# EAGLE design espuno (EAGLE 7.4.0)
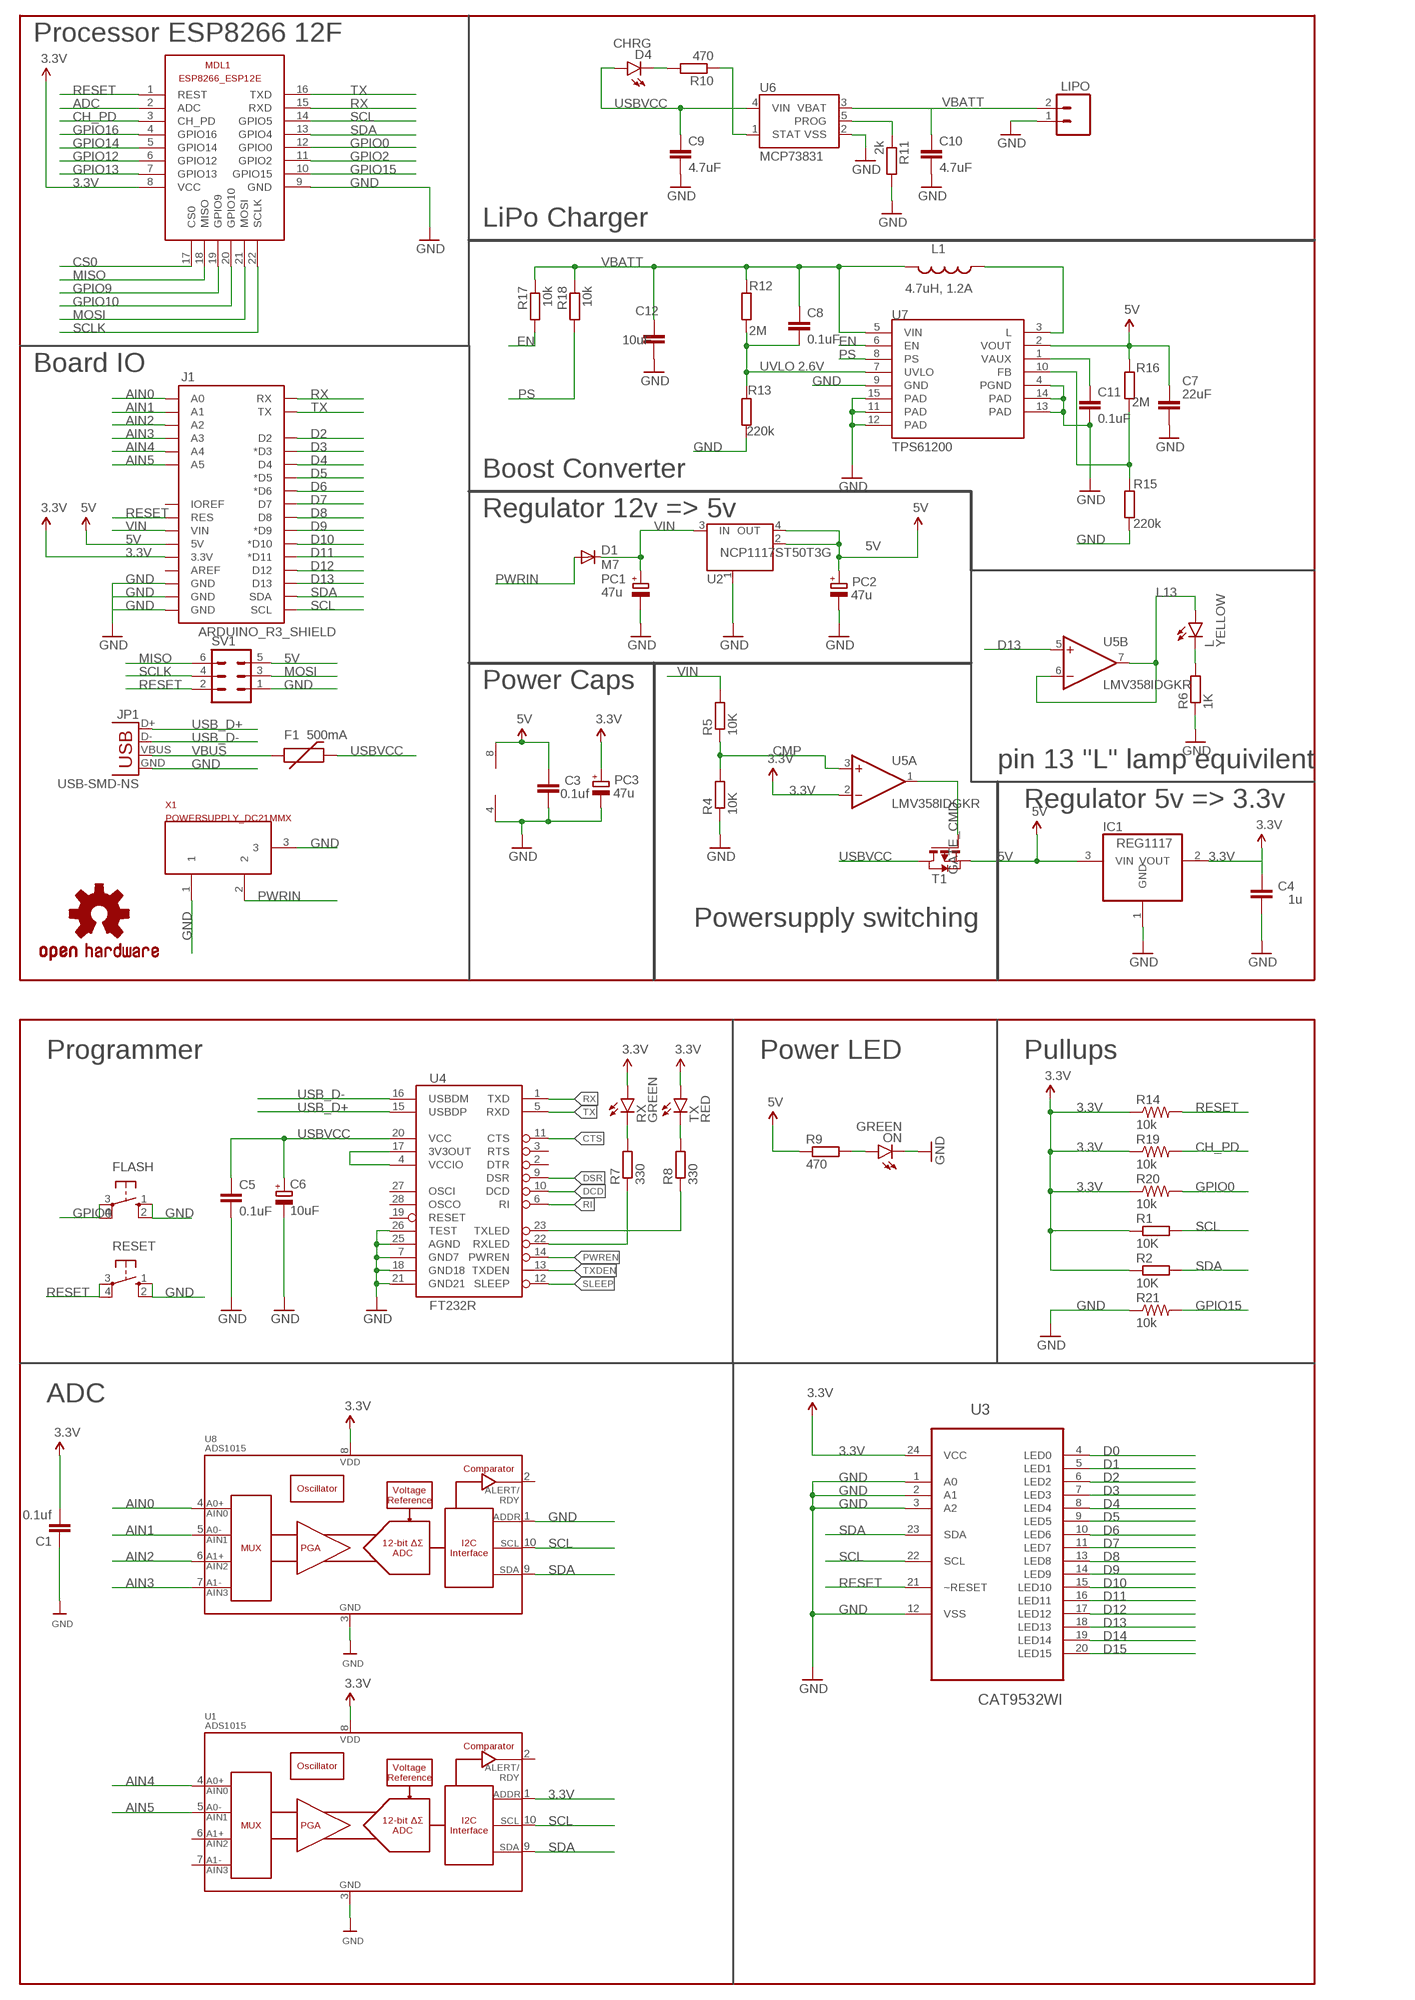
[diagram p0: schematic, sheet 1]

## Parts
C1  0.1uf  CAP1206  [1206]
C3  0.1uf  C-EUC1206K  [C1206K]
C4  1u  C-EUC1206K  [C1206K]
C5  0.1uF  C-EUC1206K  [C1206K]
C6  10uF  CPOL-EUSMCA  [SMC_A]
C7  22uF  C-EUC1206K  [C1206K]
C8  0.1uF  C-EUC1206K  [C1206K]
C9  4.7uF  C-EUC1206K  [C1206K]
C10  4.7uF  C-EUC1206K  [C1206K]
C11  0.1uF  C-EUC1206K  [C1206K]
C12  10uF  C-EUC1206K  [C1206K]
D1  M7  DIODE-SMB  [SMB]
D4  CHRG  LED1206  [LED-1206]
F1  500mA  PTCSMD  [PTC-1206]
FLASH  10-XX  [B3F-10XX]
FRAME1  FRAME-LETTERNO_PACKAGE  [DUMMY]
FRAME2  FRAME-LETTERNO_PACKAGE  [DUMMY]
IC1  REG1117  [SOT223]
J1  ARDUINO_R3_SHIELD  [UNO_R3_SHIELD]
JP1  USB-SMD-NS  [USB-MINIB-NOSTOP]
L  YELLOW  LED1206  [LED-1206]
L1  4.7uH, 1.2A  INDUCTOR.  [CDRH2D09]
LIPO  M02JST-PTH-2  [JST-2-PTH]
LOGO1  OSHW-LOGOS  [OSHW-LOGO-S]
MDL1  ESP8266-12EESP8266-ESP12E  [ESP8266-ESP12E]
ON  GREEN  LED1206  [LED-1206]
PC1  47u  CPOL-EUD  [PANASONIC_D]
PC2  47u  CPOL-EUD  [PANASONIC_D]
PC3  47u  CPOL-EUD  [PANASONIC_D]
R1  10K  R-EU_M1206  [M1206]
R2  10K  R-EU_M1206  [M1206]
R4  10K  R-EU_M1206  [M1206]
R5  10K  R-EU_M1206  [M1206]
R6  1K  R-EU_M1206  [M1206]
R7  330  R-EU_M1206  [M1206]
R8  330  R-EU_M1206  [M1206]
R9  470  R-EU_M1206  [M1206]
R10  470  R-EU_M1206  [M1206]
R11  2k  R-EU_M1206  [M1206]
R12  2M  R-EU_M1206  [M1206]
R13  220k  R-EU_M1206  [M1206]
R14  10k  RESISTOR1206  [1206]
R15  220k  R-EU_M1206  [M1206]
R16  2M  R-EU_M1206  [M1206]
R17  10k  R-EU_M1206  [M1206]
R18  10k  R-EU_M1206  [M1206]
R19  10k  RESISTOR1206  [1206]
R20  10k  RESISTOR1206  [1206]
R21  10k  RESISTOR1206  [1206]
RESET  10-XX  [B3F-10XX]
RX  GREEN  LED1206  [LED-1206]
SV1  MA03-2  [MA03-2]
T1  FDN340P  PMOSSOT23  [SOT-23]
TX  RED  LED1206  [LED-1206]
U1  ADS1015  [MSOP10]
U2  NCP1117ST50T3G  MC33269ST-3.3T3  [SOT223]
U3  CAT9532WI  [SOIC127P1031X265-24N]
U4  FT232R  FT232RLSSOP  [SSOP28DB]
U5  LMV358IDGKR  LMV358MMX  [MSOP08]
U6  MCP73831  [SOT23-5]
U7  TPS61200  [QFN-10_PAD]
U8  ADS1015  [MSOP10]
X1  POWERSUPPLY_DC21MMX  [POWERSUPPLY_DC-21MM]

## Nets
3.3V: C1.2 C4.2 IC1.2(VOUT) J1.3.3V MDL1.8(VCC) PC3.+ R1.1 R2.1 R14.1 R19.1 R20.1 RX.A TX.A U1.1(ADDR) U1.8(VDD) U3.24(VCC) U5.2(A:-IN) U8.8(VDD)
5V: C3.2 C7.1 IC1.3(VIN) J1.5V PC2.+ R9.1 R16.2 SV1.5 T1.2(S) U2.2(OUT) U2.4(OUT) U5.8(P:V+) U7.2(VOUT)
ADC: MDL1.2(ADC)
AIN0: J1.A0 U8.4(AIN0)
AIN1: J1.A1 U8.5(AIN1)
AIN2: J1.A2 U8.6(AIN2)
AIN3: J1.A3 U8.7(AIN3)
AIN4: J1.A4 U1.4(AIN0)
AIN5: J1.A5 U1.5(AIN1)
CH_PD: MDL1.3(CH_PD) R19.2
CMP: R4.2 R5.1 U5.3(A:+IN)
CS0: MDL1.17(CS0)
CTS: U4.11(CTS)
D0: U3.4(LED0)
D1: U3.5(LED1)
D2: J1.D2 U3.6(LED2)
D3: J1.D3(*D3) U3.7(LED3)
D4: J1.D4 U3.8(LED4)
D5: J1.D5(*D5) U3.9(LED5)
D6: J1.D6(*D6) U3.10(LED6)
D7: J1.D7 U3.11(LED7)
D8: J1.D8 U3.13(LED8)
D9: J1.D9(*D9) U3.14(LED9)
D10: J1.D10(*D10) U3.15(LED10)
D11: J1.D11(*D11) U3.16(LED11)
D12: J1.D12 U3.17(LED12)
D13: J1.D13 U3.18(LED13) U5.5(B:+IN)
D14: U3.19(LED14)
D15: U3.20(LED15)
DCD: U4.10(DCD)
DSR: U4.9(DSR)
EN: R17.2 U7.6(EN)
FB: R15.2 R16.1 U7.10(FB)
GATE_CMD: T1.3(G) U5.1(A:OUT)
GND: C1.1 C3.1 C4.1 C5.2 C6.- C7.2 C9.2 C10.2 C11.2 C12.2 FLASH.1(S) FLASH.2(S1) IC1.1(GND) J1.GND@0(GND) J1.GND@1(GND) J1.GND@2(GND) JP1.GND LIPO.1 MDL1.9(GND) ON.C PC1.- PC2.- PC3.- R4.1 R6.1 R11.2 R13.1 R15.1 R21.1 RESET.1(S) RESET.2(S1) SV1.1 U1.3(VSS) U2.1(GND/ADJ) U3.1(A0) U3.2(A1) U3.3(A2) U3.12(VSS) U4.7(GND7) U4.18(GND18) U4.21(GND21) U4.25(AGND) U4.26(TEST) U5.4(P:V-) U6.2(VSS) U7.4(PGND) U7.9(GND) U7.11(PAD) U7.12(PAD) U7.13(PAD) U7.14(PAD) U7.15(PAD) U8.1(ADDR) U8.3(VSS) X1.1 X1.3
GPIO0: FLASH.3(P) FLASH.4(P1) MDL1.12(GPIO0) R20.2
GPIO2: MDL1.11(GPIO2)
GPIO9: MDL1.19(GPIO9)
GPIO10: MDL1.20(GPIO10)
GPIO12: MDL1.6(GPIO12)
GPIO13: MDL1.7(GPIO13)
GPIO14: MDL1.5(GPIO14)
GPIO15: MDL1.10(GPIO15) R21.2
GPIO16: MDL1.4(GPIO16)
L13: L.A U5.6(B:-IN) U5.7(B:OUT)
MISO: MDL1.18(MISO) SV1.6
MOSI: MDL1.21(MOSI) SV1.3
N$1: ON.A R9.2
N$2: L.C R6.2
N$3: R7.2 RX.C
N$4: R8.2 TX.C
N$5: L1.P$1 U7.3(L)
N$6: C11.1 U7.1(VAUX)
N$7: R7.1 U4.22(RXLED)
N$8: D4.C R10.2
N$9: R8.1 U4.23(TXLED)
N$10: U4.4(VCCIO) U4.17(3V3OUT)
N$11: R11.1 U6.5(PROG)
N$14: R10.1 U6.1(STAT)
PS: R18.2 U7.8(PS)
PWREN: U4.14(PWREN)
PWRIN [power]: D1.A X1.2
RESET: J1.RES MDL1.1(REST) R14.2 RESET.3(P) RESET.4(P1) SV1.2 U3.21(~RESET)
RI: U4.6(RI)
RX: J1.RX MDL1.15(RXD) U4.1(TXD)
SCL: J1.SCL MDL1.14(GPIO5) R1.2 U1.10(SCL) U3.22(SCL) U8.10(SCL)
SCLK: MDL1.22(SCLK) SV1.4
SDA: J1.SDA MDL1.13(GPIO4) R2.2 U1.9(SDA) U3.23(SDA) U8.9(SDA)
SLEEP: U4.12(SLEEP)
TX: J1.TX MDL1.16(TXD) U4.5(RXD)
TXDEN: U4.13(TXDEN)
USB_D+: JP1.D+ U4.15(USBDP)
USB_D-: JP1.D- U4.16(USBDM)
USBVCC: C5.1 C6.+ C9.1 D4.A F1.2 T1.1(D) U4.20(VCC) U6.4(VIN)
UVLO: C8.2 R12.1 R13.2 U7.7(UVLO)
VBATT: C8.1 C10.1 C12.1 L1.P$2 LIPO.2 R12.2 R17.1 R18.1 U6.3(VBAT) U7.5(VIN)
VBUS: F1.1 JP1.VBUS
VIN: D1.C J1.VIN PC1.+ R5.2 U2.3(IN)
Unconnected: J1.AREF J1.IOREF U1.2(ALERT/RDY) U1.6(AIN2) U1.7(AIN3) U4.2(DTR) U4.3(RTS) U4.19(RESET) U4.27(OSCI) U4.28(OSCO) U8.2(ALERT/RDY)

## Notes on the sheet
- Processor ESP8266 12F
- LiPo Charger
- Board IO | UVLO 2.6V
- Boost Converter
- Regulator 12v => 5v
- Power Caps
- pin 13 "L" lamp equivilent
- Regulator 5v => 3.3v
- Powersupply switching
- Programmer | Power LED | Pullups
- ADC

## Library data of the parts
C1 = SparkFun-Capacitors:CAP: Capacitor Standard 0603 ceramic capacitor, and 0.1" leaded capacitor.
C3-C5 C7-C12 = rcl:C-EU: CAPACITOR, European symbol
C6 PC1-PC3 = rcl:CPOL-EU: POLARIZED CAPACITOR, European symbol
D1 = diode:DIODE-: DIODE
D4 L ON RX TX = SparkFun-LED:LED: LEDs Standard schematic elements and footprints for 5mm, 3mm, 1206, and 0603 sized LEDs. 5mm - Spark Fun Electronics SKU : COM-00529 (and others)
F1 = SparkFun:PTC: Resettable Fuse PTC Resettable Fuse. Spark Fun Electronics SKU : COM-08357
FLASH RESET = switch-omron:10-XX: OMRON SWITCH; MPN: B3F-1000; OC_FARNELL: 176432; OC_NEWARK: 36M3542
FRAME1 FRAME2 = SparkFun-Aesthetics:FRAME-LETTER: Schematic Frame Standard 8.5x11 US Letter frame; DESIGNER: Nobody; VERSION: v01
IC1 = burr-brown:REG1117: 800mA and 1A Low Dropout (LDO) Positive Regulator 1.8V, 2.5V, 2.85V, 3.3V, 5V, and Adj; MPN: REG1117; OC_FARNELL: 1097566; OC_NEWARK: 14P6981
J1 = SparkFun-Boards:ARDUINO_R3_SHIELD: Shield form compatible with the Arduino Uno R3.
JP1 = SparkFun-Connectors:USB: USB Connectors USB-B-PTH is fully proven SKU : PRT-00139/CONN-08278 USB-miniB is fully proven SKU : PRT-00587 USB-A-PCB is untested. USB-A-H is throughly reviewed, but untested. Spark Fun Electronics SKU : PRT-00437 USB-B-SMT is throughly reviewed, but untested. Needs silkscreen touching up. USB-A-S has not been used/tested USB-MB-H has not been used/tested USB-MICROB has been used. CONN-09505
L1 = SparkFun:INDUCTOR: Inductors Basic Inductor/Choke - 0603 and 1206. Footprints are not proven and vary greatly between part numbers.
LIPO = SparkFun-Connectors:M02: Standard 2-pin 0.1" header. Use with - straight break away headers ( PRT-00116) - right angle break away headers (PRT-00553) - swiss pins (PRT-00743) - machine pins (PRT-00117) - female headers (PRT-00115) Molex polarized connector foot print use with: PRT-08233 with associated crimp pins and housings. 2.54_SCREWTERM for use with PRT-10571. 3.5mm Screw Terminal footprints for PRT-08084 5mm Screw Terminal footprints for use with PRT-08432; PROD_ID: CONN-09863; SKU: PRT-09914
LOGO1 = SparkFun-Aesthetics:OSHW-LOGO: Open Source Hardware Logo This logo indicates the piece of hardware it is found on incorporates a OSHW license and/or adheres to the definition of open source hardware found here: http://freedomdefined.org/OSHW
MDL1 = ESP8266-ESP12E:ESP8266-12E: ESP8266-12E with additional I/O and GPIO04/05 corrected The author cannot warrant that this library is free from error or will meet your specific requirements. Created by PuceBaboon.com. Komagane, Nagano, JAPAN
R1 R2 R4-R13 R15-R18 = rcl:R-EU_: RESISTOR, European symbol
R14 R19-R21 = SparkFun-Resistors:RESISTOR: Resistor Basic schematic elements and footprints for 0603, 1206, and PTH resistors.
SV1 = con-lstb:MA03-2: PIN HEADER; OC_FARNELL: unknown; OC_NEWARK: unknown
T1 = zetex:PMOSSOT23: MOS FET
U1 U8 = SparkFun-AnalogIC:ADS1015: 12-Bit Del-Sig ADC Four single-ended inputs or two differential inputs Internal PGA I2C interface 2.0-5.5V; PROD_ID: IC-12239
U2 = linear:MC33269ST*: Adjustable Output Low Dropout Voltage Regulator 800 mA Source: http://www.onsemi.com/pub/Collateral/MC33269-D.PDF
U3 = ON Semiconductor_By_element14_Batch_1:CAT9532WI: 16-bit Programmable LED Dimmer with I2C Interface; MPN: CAT9532WI.; OC_FARNELL: 1656134; OC_NEWARK: 11P0275; PACKAGE: SOIC-24; SUPPLIER: On Semiconductor
U4 = SparkFun:FT232RL: USB UART FT232RL 4th Generation USB UART (USB <-> Serial) Controller. Spark Fun Electronics SKU : COM-00650
U5 = linear:LMV358?*: Dual General Purpose, Low Voltage, Rail-to-Rail Output Operational Amplifiers Source: http://www.national.com/mpf/LM/LMV321.html http://www.national.com/dt/lmv_qual.pdf
U6 = SparkFun:MCP73831: Microchip's MCP73831 Miniature single cell, fully integrated Li-Ion, Li-polymer charge management controller http://ww1.microchip.com/downloads/en/DeviceDoc/21984a.pdf
U7 = SparkFun:TPS61200: DC to DC Booster
X1 = SmartPrj:POWERSUPPLY_DC21MM

## Net classes
1 power: width 0.61 mm, drill 0.61 mm, clearance 0.254 mm
2 gnd: width 0.305 mm, drill 0.559 mm, clearance 0.254 mm
3 usbvcc: width 0.508 mm, drill 0.61 mm, clearance 0.254 mm

## Board
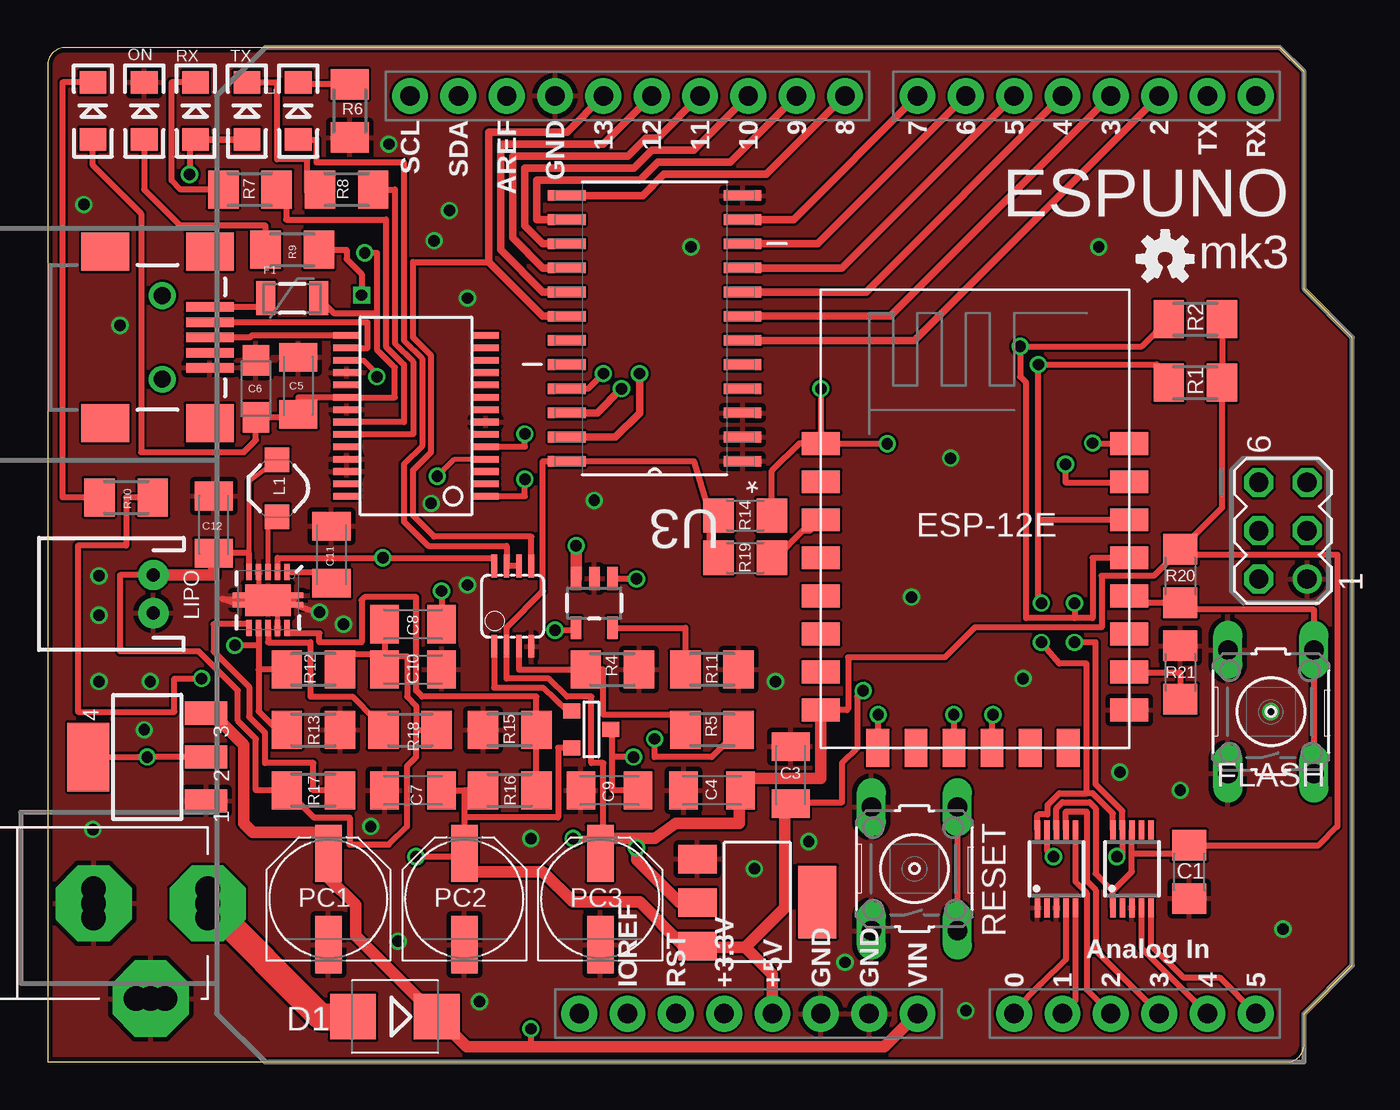
[diagram p1: board, top side]
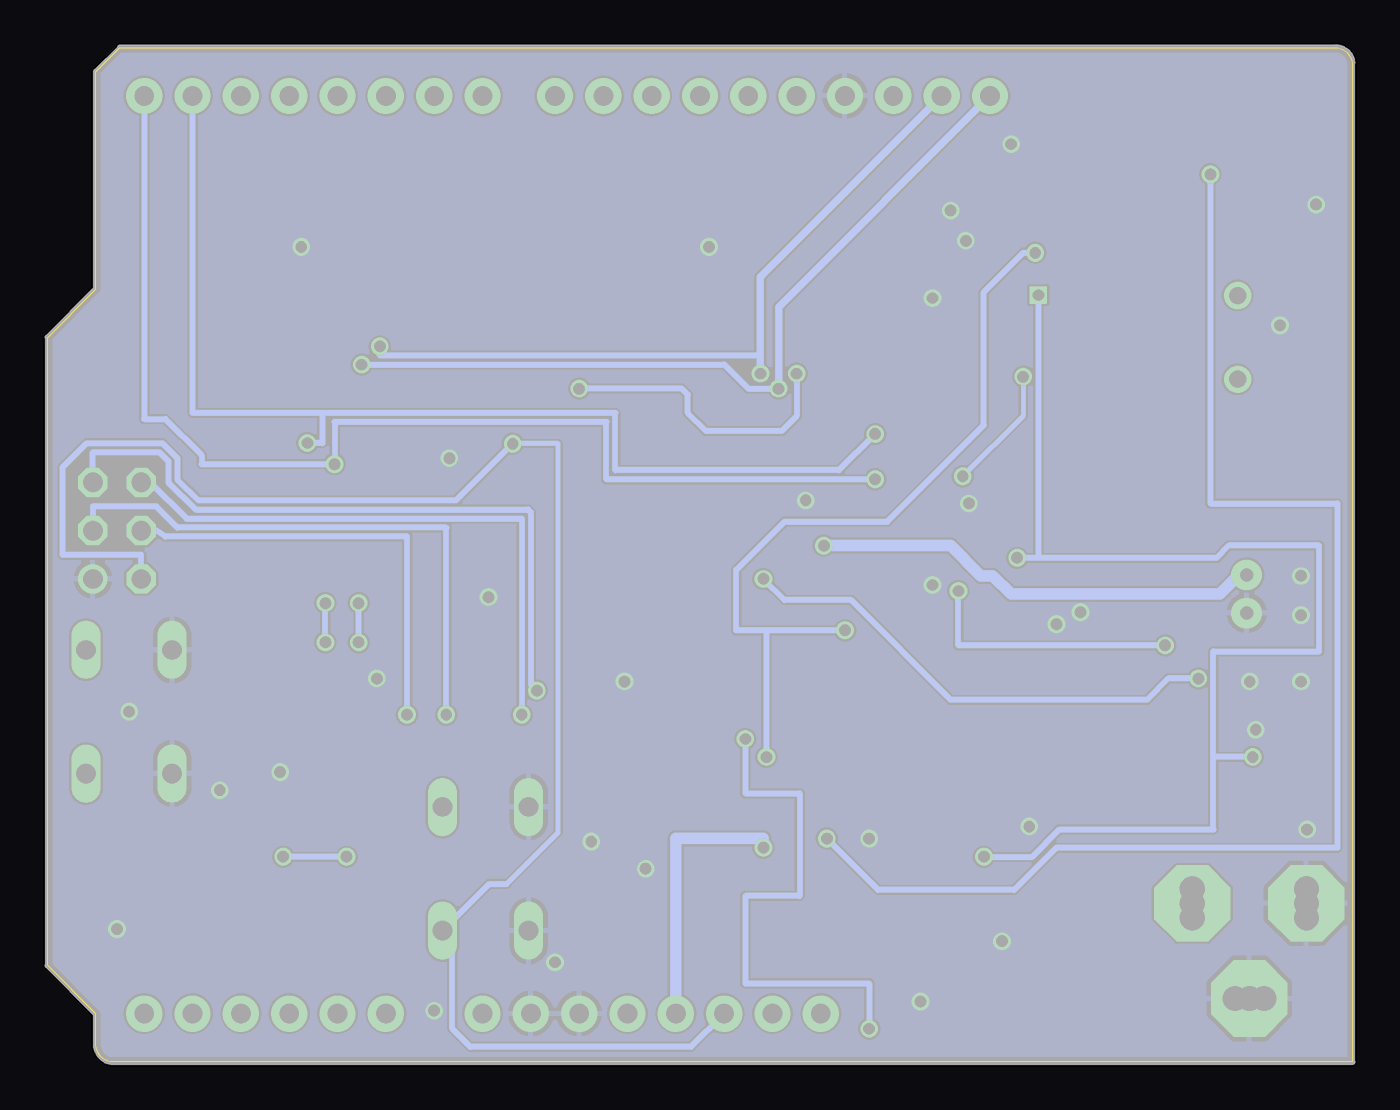
[diagram p2: board, bottom side, seen from below]

Size 68.58 x 53.34 mm. Coordinates in mm from the lower left corner, seen from the top.
Outline: 0,0 65.23,0 arc90 66.04,1.11 66.04,2.54 68.58,5.08 68.58,38.1 66.04,40.64 66.04,52.07 64.78,53.34 0.95,53.34 arc90 0,52.39 0,0
Copper layers (1*16): Top 0.035mm / dielectric 1.5mm / Bottom 0.035mm
Design rules "dirtypcbs": minimum track width 5mil, minimum drill 12mil, track to track 5mil, track to pad 5mil, pad to pad 5mil, via to via 5mil, smd to smd 0mil, copper to edge 10mil, drill to drill 10mil, minimum pad ring 10mil, minimum via ring 6mil, stop-mask expansion 2mil, vias tented up to drill 25mil, thermal gap 10mil

### Footprints (pad centres in the part's own frame; a part is rotated, then mirrored left to right if it is on the bottom)
1206 = smd 1.6 x 1.8: 1 -1.4,0; 2 1.4,0
C1206K = smd 1.5 x 2: 1 -1.5,0; 2 1.5,0
SMC_A = smd 1.6 x 1.4: + -1.5,0; - 1.5,0
SMB = smd 2.4 x 2.4: A 2.2,0; C -2.2,0
LED-1206 = smd 1.2 x 1.4: A -1.5,0; C 1.5,0
PTC-1206 = smd 1 x 1.8: 1 -1.4,0; 2 1.4,0
B3F-10XX = drill 1.016 long: 1 -3.251,2.261; 2 3.251,2.261; 3 -3.251,-2.261; 4 3.251,-2.261
SOT223 = smd 1.499 x 2.007: 1 -2.261,-3.15; 2 0.025,-3.15; 3 2.311,-3.15 | smd 3.81 x 2.007: 4 0,3.15
UNO_R3_SHIELD = drill 1.016 pad 1.88: 3.3V 50.8,26.67; 5V 50.8,29.21; A0 50.8,41.91; A1 50.8,44.45; A2 50.8,46.99; A3 50.8,49.53; A4 50.8,52.07; A5 50.8,54.61; AREF 2.54,15.24; D2 2.54,49.53; D3 2.54,46.99; D4 2.54,44.45; D5 2.54,41.91; D6 2.54,39.37; D7 2.54,36.83; D8 2.54,33.02; D9 2.54,30.48; D10 2.54,27.94; D11 2.54,25.4; D12 2.54,22.86; D13 2.54,20.32; GND@0 50.8,31.75; GND@1 50.8,34.29; GND@2 2.54,17.78; IOREF 50.8,21.59; NC 50.8,19.05; RES 50.8,24.13; RX 2.54,54.61; SCL 2.54,10.16; SDA 2.54,12.7; TX 2.54,52.07; VIN 50.8,36.83
USB-MINIB-NOSTOP = smd 2.5 x 0.5: D+ 2.5,0; D- 2.5,0.8; GND 2.5,-1.6; ID 2.5,-0.8; VBUS 2.5,1.6 | smd 2.5 x 2: G1 -3,-4.5; G2 -3,4.5; G3 2.5,4.5; G4 2.5,-4.5 | drill 0.9 pad 0.8: H1 0,2.2 | drill 0.9 pad 0.787: H2 0,-2.2
CDRH2D09 = smd 1.3 x 1.3: P$1 -1.5,0; P$2 1.5,0
JST-2-PTH = drill 0.7 pad 1.6: 1 -1,0; 2 1,0
ESP8266-ESP12E = smd 2 x 1.2: 1 0,16; 2 0,14; 3 0,12; 4 0,10; 5 0,8; 6 0,6; 7 0,4; 8 0,2; 9 16.2,2; 10 16.2,4; 11 16.2,6; 12 16.2,8; 13 16.2,10; 14 16.2,12; 15 16.2,14; 16 16.2,16 | smd 1.2 x 2: 17 11,0; 18 3,0; 19 5,0; 20 13,0; 21 7,0; 22 9,0
PANASONIC_D = smd 3 x 1.4: + 2.4,0; - -2.4,0
M1206 = smd 1.6 x 2: 1 -1.4,0; 2 1.4,0
MA03-2 = drill 1.016: 1 -2.54,-1.27 | drill 1.016 octagon: 2 -2.54,1.27; 3 0,-1.27; 4 0,1.27; 5 2.54,-1.27; 6 2.54,1.27
SOT-23 = smd 0.787 x 0.889: 1 0.025,-1.016; 2 -0.94,1.016; 3 0.991,1.016
MSOP10 = smd 0.3 x 1: 1 -1,-2.05; 2 -0.5,-2.05; 3 0,-2.05; 4 0.5,-2.05; 5 1,-2.05; 6 1,2.05; 7 0.5,2.05; 8 0,2.05; 9 -0.5,2.05; 10 -1,2.05
SOT223' = smd 1.219 x 2.235: 1 -2.311,-3.099; 2 0,-3.099; 3 2.311,-3.099 | smd 3.6 x 2.2: 4 0,3.099
SOIC127P1031X265-24N = smd 1.981 x 0.559: 1 -4.623,6.985; 2 -4.623,5.715; 3 -4.623,4.445; 4 -4.623,3.175; 5 -4.623,1.905; 6 -4.623,0.635; 7 -4.623,-0.635; 8 -4.623,-1.905; 9 -4.623,-3.175; 10 -4.623,-4.445; 11 -4.623,-5.715; 12 -4.623,-6.985; 13 4.623,-6.985; 14 4.623,-5.715; 15 4.623,-4.445; 16 4.623,-3.175; 17 4.623,-1.905; 18 4.623,-0.635; 19 4.623,0.635; 20 4.623,1.905; 21 4.623,3.175; 22 4.623,4.445; 23 4.623,5.715; 24 4.623,6.985
SSOP28DB = smd 0.348 x 1.397: 1 -4.225,-3.656; 2 -3.575,-3.656; 3 -2.925,-3.656; 4 -2.275,-3.656; 5 -1.625,-3.656; 6 -0.975,-3.656; 7 -0.325,-3.656; 8 0.325,-3.656; 9 0.975,-3.656; 10 1.625,-3.656; 11 2.275,-3.656; 12 2.925,-3.656; 13 3.575,-3.656; 14 4.225,-3.656; 15 4.225,3.656; 16 3.575,3.656; 17 2.925,3.656; 18 2.275,3.656; 19 1.625,3.656; 20 0.975,3.656; 21 0.325,3.656; 22 -0.325,3.656; 23 -0.975,3.656; 24 -1.625,3.656; 25 -2.275,3.656; 26 -2.925,3.656; 27 -3.575,3.656; 28 -4.225,3.656
MSOP08 = smd 0.3 x 1.2: 1 -0.976,-2.113; 2 -0.326,-2.113; 3 0.324,-2.113; 4 0.974,-2.113; 5 0.974,2.112; 6 0.324,2.112; 7 -0.326,2.112; 8 -0.976,2.112
SOT23-5 = smd 0.55 x 1.2: 1 -0.95,-1.3; 2 0,-1.3; 3 0.95,-1.3; 4 0.95,1.3; 5 -0.95,1.3
QFN-10_PAD = smd 0.297 x 0.85: 1 -1,-1.475; 2 -0.5,-1.475; 3 0,-1.475; 4 0.5,-1.475; 5 1,-1.475; 6 1,1.475; 7 0.5,1.475; 8 0,1.475; 9 -0.5,1.475; 10 -1,1.475 | smd 0.7 x 0.28: 11 -1.5,0.25; 12 -1.5,-0.25; 13 1.5,0.25; 14 1.5,-0.25 | smd 2.4 x 1.65: 15 0,0
POWERSUPPLY_DC-21MM = drill 1.3 pad 4 octagon: 1 -5.08,-3.353; 2 -0.076,-6.35; 3 -0.076,-0.356 | drill 1.3: 4 -5.08,-4.115; 5 -5.08,-2.591; 6 -0.838,-0.356; 7 0.686,-0.356; 8 -0.838,-6.35; 9 0.686,-6.35

### Placement (x,y rotation side)
C1  60.01,10 90 top
C3  39.05,15.08 270 top
C4  34.92,14.29 0 top
C5  13.18,35.56 90 top
C6  10.95,35.4 90 top
C7  19.21,14.29 180 top
C8  19.21,23.02 0 top
C9  29.53,14.29 180 top
C10  19.21,20.64 0 top
C11  14.92,26.67 90 top
C12  8.73,28.26 90 top
D1  18.26,2.38 180 top
D4  2.38,50.01 90 top
F1  12.86,40.16 0 top
FLASH  64.29,18.41 90 top
FRAME1  -5.71,-4.13 0 top  (outside the outline)
FRAME2  -5.71,-6.19 0 top  (outside the outline)
IC1  37.31,8.41 270 top
J1  8.89,53.34 270 top
JP1  6.03,38.1 0 top
L  13.18,50.01 90 top
L1  12.06,30.16 90 top
LIPO  5.56,24.61 90 top
LOGO1  58.74,42.23 0 top
MDL1  40.64,16.51 0 top
ON  5.08,50.01 90 top
PC1  14.76,8.57 90 top
PC2  21.91,8.57 90 top
PC3  29.05,8.57 90 top
R1  60.33,35.72 180 top
R2  60.33,39.05 180 top
R4  29.69,20.64 180 top
R5  34.92,17.46 0 top
R6  15.88,50.01 90 top
R7  10.64,45.88 180 top
R8  15.72,45.88 180 top
R9  12.86,42.7 180 top
R10  4.13,29.69 180 top
R11  34.92,20.64 0 top
R12  13.97,20.64 0 top
R13  13.97,17.46 180 top
R14  36.67,28.73 0 top
R15  24.29,17.46 0 top
R16  24.29,14.29 180 top
R17  13.97,14.29 0 top
R18  19.05,17.46 180 top
R19  36.67,26.51 0 top
R20  59.53,25.56 270 top
R21  59.53,20.48 270 top
RESET  45.56,10.16 90 top
RX  7.78,50.01 90 top
SV1  64.93,27.94 90 top
T1  28.57,17.46 90 top
TX  10.48,50.01 90 top
U1  56.99,10.16 0 top
U2  NCP1117ST50T3G  [SOT223']  5.24,16.03 90 top
U3  31.91,38.58 180 top
U4  19.37,33.97 90 top
U5  24.45,23.97 0 top
U6  28.73,24.13 180 top
U7  11.59,24.29 180 top
U8  53.02,10.16 0 top
X1  2.06,8.41 90 top

### Tracks (layer width: path | path; a pad name or v marks a point on that pad's centre or on a via)
3.3V  (via drill 0.6)
  Top 0.305: C4.2 36.35,14.45 36.35,12.54 | 27.29,31.7 U3.24 | U3.24 26.04,31.59 26.04,24.77 24.12,22.85 U5.2 24.12,20.16 26.35,20.16 27.3,19.21 28.57,19.21 28.57,15.72 29.21,15.72 29.21,11.75 28.57,11.75 v27.62,11.75 | RX.A TX.A 7.46,48.51 v7.46,46.67 | R2.1 R1.1 | R1.1 61.73,34.95 | R20.1 61.73,29.15 R1.1 | U3.24 33.97,31.59 34.77,28.89 34.77,28.73 | 34.77,28.73 34.77,26.35 35.27,26.35 R19.1 | R14.1 34.77,28.73 | U1.1 55.99,9 | 55.99,9 56.99,10 56.99,10.95 | 56.99,10.95 U1.8 | U8.8 53.02,13.34 53.34,13.65 54.77,13.65 55.09,13.34 55.09,9.91 55.99,9 | 56.99,10.95 59.56,10.95 C1.2 66.81,11.4 67.79,12.38 67.79,26.67 59.82,26.67 R20.1 | R20.1 58.13,25.56 55.4,25.56 55.4,22.86 48.74,22.86 47.15,21.27 42.07,21.27 42.07,18.57 42.01,18.51 MDL1.8
  Top 0.61: 29.05,11.75 PC3.+ 29.21,10.97 29.21,11.75 | 29.05,11.75 28.57,11.75 | 29.05,11.75 29.21,11.75 | 30.96,11.75 v30.96,11.27 30.96,10.64 33.2,8.39 IC1.2 | MDL1.8 40.64,14.92 36.35,14.92 36.35,12.54 33.02,12.54 31.91,11.75 30.96,11.75 | 30.96,11.75 29.21,11.75
  Bottom 0.305: v7.46,46.67 7.46,29.37 0.79,29.37 0.79,11.27 15.56,11.27 17.78,9.05 24.92,9.05 v27.62,11.75
  Bottom 0.61: v30.96,11.27 30.96,11.75 35.56,11.75 J1.3.3V
5V  (via drill 0.6)
  Top 0.305: U7.2 12.09,26.51 v17.62,26.51 23.47,26.51 U5.8 | R9.1 15.72,42.7 15.72,42.23 16.51,41.43 v16.51,40.32 | U2.4 v5.24,16.03 U2.2 | v19.37,10.79 21.91,10.79 PC2.+ 21.91,12.86 | T1.2 26.83,16.52 26.83,12.86 21.91,12.86 | C7.1 21.91,14.29 | 21.91,14.29 21.91,12.86 | R16.2 21.91,14.29 | v42.86,19.53 42.55,19.21 42.55,16.51 41.75,15.72 41.75,13.65 39.12,13.65 C3.2
  Top 0.61: PC2.+ 21.91,10 26.04,10 27.62,8.41 31.11,8.41 33.34,6.19 34.07,6.19 IC1.3 34.23,6.03 36.67,6.03 | J1.5V 38.1,4.6 36.67,6.03 | C3.2 39.05,13.49 38.73,13.49 38.73,8.1 36.67,6.03
  Bottom 0.305: v16.51,40.32 16.51,26.51 v17.62,26.51 7.14,26.51 6.51,27.15 1.75,27.15 1.75,21.59 7.3,21.59 7.3,16.03 | v5.24,16.03 7.3,16.03 | v19.37,10.79 16.83,10.79 15.4,12.22 7.3,12.22 7.3,16.03 | SV1.5 66.2,32.07 62.71,32.07 62.23,31.59 62.23,30.48 60.8,29.05 43.34,29.05 43.18,28.89 43.18,19.84 v42.86,19.53
AIN0
  Top 0.305: U8.4 53.52,5.4 52.23,4.13 50.8,2.7 J1.A0
AIN1
  Top 0.305: U8.5 54.02,3.22 J1.A1
AIN2
  Top 0.305: U8.6 54.02,9.48 54.61,8.89 54.61,3.81 J1.A2
AIN3
  Top 0.305: U8.7 53.52,13.18 54.61,13.18 54.61,9.53 55.09,9.05 55.09,5.87 J1.A3
AIN4
  Top 0.305: U1.4 57.49,6.01 J1.A4
AIN5
  Top 0.305: U1.5 57.99,6.14 59.69,4.45 61.59,4.45 J1.A5
CH_PD
  Top 0.305: R19.2 38.26,26.51 39.69,27.94 40.07,27.94 MDL1.3
CMP
  Top 0.305: U5.3 24.77,20.64 R4.2 29.21,20.64 29.21,18.26 33.52,18.26 R5.1
D2
  Top 0.406: U3.6 45.56,37.94 J1.D2
D3
  Top 0.406: U3.7 44.29,39.21 J1.D3
D4
  Top 0.406: U3.8 43.02,40.48 J1.D4
D5
  Top 0.406: U3.9 41.75,41.75 J1.D5
D6
  Top 0.406: U3.10 40.48,43.02 J1.D6
D7
  Top 0.406: U3.11 39.21,44.29 J1.D7
D8
  Top 0.406: U3.13 31.27,45.56 32.38,46.67 37.78,46.67 J1.D8
D9
  Top 0.406: U3.14 25.72,44.29 25.72,46.35 31.11,46.35 32.07,47.31 35.88,47.31 J1.D9
D10
  Top 0.406: J1.D10 33.97,47.94 31.75,47.94 30.8,46.99 25.08,46.99 25.08,43.97 26.04,43.02 U3.15
D11
  Top 0.406: J1.D11 32.07,48.58 31.43,48.58 30.48,47.62 24.45,47.62 24.45,43.34 26.04,41.75 U3.16
D12
  Top 0.406: J1.D12 29.21,48.26 23.81,48.26 23.81,42.7 26.04,40.48 U3.17
D13
  Top 0.305: U5.5 25.42,27.62 20.32,27.62 19.21,28.73 19.21,31.11 20.16,32.07 20.16,37.15 19.21,38.1 19.21,42.07 23.18,42.07
  Top 0.406: J1.D13 27.3,48.9 23.18,48.9 23.18,42.07 26.04,39.21 U3.18
EN
  Top 0.305: R17.2 13.97,14.29 13.97,15.72 11.43,15.72 11.43,17.3 10.59,18.14 10.59,19.73 8.73,21.59 8.73,23.02 10.59,23.02 U7.6
FB
  Top 0.305: R16.1 R15.2 25.69,19.21 19.68,19.21 19.37,19.53 19.37,24.45 16.67,24.45 16.51,24.29 16.51,22.07 14.29,22.07 14.29,22.54 12.7,22.54 12.59,22.65 U7.10
GATE_CMD
  Top 0.305: U5.1 23.47,19.68 26.04,19.68 27.3,18.45 T1.3
GND  (via drill 0.6)
  Top 0.254: U7.4 11.09,24.29 U7.15 12.09,23.97 U7.9
  Top 0.305: U7.12 12.72,24.06 12.09,23.97 | U7.13 9.18,24.36 11.09,24.29 | U7.11 13.63,23.81 v14.29,23.65 | C10.2 20.71,21.43 20.16,21.43
  other vias: 2.7,23.5 64.29,18.41 17.94,48.26 15.56,23.02 25.4,11.75 22.07,25.08 16.99,12.38 18.41,6.35 2.38,12.22 2.7,20 5.4,20 2.7,25.56 28.73,29.53 56.36,15.24 59.53,14.29 64.93,6.99 45.4,24.45 22.07,40.16 51.28,20.16 47.47,31.75 21.11,44.77 55.24,42.86 38.26,20 40.01,11.59 5.08,17.46 33.81,42.86 41.91,5.24 20.16,29.37 3.81,38.73 1.91,45.09 20.32,43.18 22.7,3.17 48.26,2.7 37.15,10.16
  pour Top: 0,45.72 0,1.27 arc90 1.27,0 65.41,0 arc90 66.04,0.64 66.04,2.54 68.58,5.08 68.58,38.1 66.04,40.64 66.04,52.07 64.77,53.34 1.91,53.34 1.27,53.34 arc90 0,52.07
  pour Bottom: 0,48.9 0,1.27 arc90 1.27,0 64.77,0 65.41,0 arc90 66.04,0.64 66.04,2.54 68.58,5.08 68.58,38.1 66.04,40.64 66.04,52.07 64.77,53.34 2.54,53.34 1.27,53.34 arc90 0,52.07
GPIO0
  Top 0.305: FLASH.3 FLASH.4 66.55,23.77 66.52,23.81 59.88,23.81 R20.2 57.19,24.16 MDL1.12
GPIO15
  Top 0.305: MDL1.10 56.87,20.48 59.53,20.48 R21.2
L13
  Top 0.305: L.A 14.13,48.51 14.13,47.31 18.73,47.31 18.73,37.94 19.68,36.99 19.68,32.38 18.73,31.43 18.73,28.42 18.72,28.42 20,27.14 24.12,27.14 U5.7 U5.6
MISO  (via drill 0.6)
  Top 0.305: v43.66,18.26 43.64,18.26 MDL1.18
  Bottom 0.305: SV1.6 63.18,30.48 61.28,28.57 43.66,28.57 v43.66,18.26
MOSI  (via drill 0.6)
  Top 0.305: MDL1.21 47.64,18.26 v47.62,18.26
  Bottom 0.305: v47.62,18.26 47.62,28.1 61.75,28.1 62.87,29.21 66.2,29.21 SV1.3
N$1
  Top 0.305: R9.2 11.46,43.97 6.99,43.97 5.08,45.88 ON.A
N$2
  Top 0.305: R6.2 13.02,51.41 L.C
N$3
  Top 0.305: R7.2 6.99,45.88 6.51,46.35 6.51,51.51 RX.C
N$4
  Top 0.305: R8.2 13.65,45.72 13.65,47.47 12.06,47.47 12.06,51.51 TX.C
N$5
  Top 0.254: U7.3 11.59,28.66 L1.P$1
N$6
  Top 0.305: U7.1 15.4,25.76 C11.1
N$7
  Top 0.305: R7.1 12.04,45.56 12.54,45.56 12.54,44.29 17.78,44.29 17.78,37.62 18.73,36.67 18.73,33.65 U4.22
N$8
  Top 0.305: R10.2 0.79,29.69 0.79,51.51 D4.C
N$9
  Top 0.305: 16.96,45.72 R8.1 18.26,45.88 18.26,37.78 19.21,36.83 19.21,33 U4.23
N$10  (via drill 0.6)
  Top 0.254: U4.17 16.6,36.9 17.3,36.2 v17.3,36.04 | v20.48,30.8 21.38,31.7 U4.4
  Bottom 0.254: v17.3,36.04 17.3,33.97 v20.48,30.8
N$11
  Top 0.305: U6.5 33.52,22.83 R11.1
N$14  (via drill 0.6)
  Top 0.305: R10.1 4.13,29.69 4.13,27.15 1.59,27.15 1.59,18.41 6.67,18.41 6.67,20.16 v8.1,20.16 | v30.96,25.4 29.71,25.4 U6.1
  Bottom 0.305: v8.1,20.16 9.68,20.16 10.79,19.05 21.11,19.05 26.35,24.29 29.84,24.29 v30.96,25.4
PS
  Top 0.305: U7.8 11.59,22.07 13.81,22.07 13.81,19.21 16.03,19.21 17.14,18.1 17.14,17.46 R18.2
PWRIN
  Top 1.422: X1.2 14.37,2.38 D1.A
RESET  (via drill 0.6)
  Top 0.305: 41.27,32.51 MDL1.1 v40.64,35.4 | 41.27,32.51 v44.13,32.51 | U3.21 28.42,35.4 v29.21,36.2 | R14.2 38.07,31.09 39.53,32.54 41.24,32.54 41.27,32.51 | RESET.4 RESET.3
  Bottom 0.254: 44.45,9.37 41.75,12.06 41.75,32.51 v44.13,32.51
  Bottom 0.305: J1.RES 34.77,0.79 46.35,0.79 47.31,1.75 47.31,7.42 | SV1.2 63.66,26.67 67.79,26.67 67.79,31.27 66.52,32.54 62.55,32.54 61.75,31.75 61.75,30.64 60.64,29.53 47.12,29.53 v44.13,32.51 | v29.21,36.2 29.21,33.97 30,33.18 33.97,33.18 34.92,34.13 34.92,35.08 35.24,35.4 v40.64,35.4 | 47.31,7.42 45.36,9.37 44.45,9.37 | 47.31,7.42 47.82,7.42 RESET.3
RX  (via drill 0.6)
  Top 0.305: U4.1 25.08,29.75 v25.08,30.64 | v53.5,31.43 53.5,30.48 56.84,30.48 MDL1.15
  Bottom 0.305: v25.08,30.64 39.21,30.64 39.21,33.66 53.5,33.66 v53.5,31.43 60.48,31.43 60.48,31.91 62.39,33.81 63.5,33.81 J1.RX
SCL  (via drill 0.6)
  Top 0.305: MDL1.14 52.07,28.51 | 52.07,28.51 v52.07,36.67 58.29,36.67 R1.2 | U1.10 55.99,13.06 54.93,14.13 54.61,14.13 | U8.10 52.02,12.97 52.07,13.02 52.55,13.02 52.55,13.49 53.18,14.13 54.61,14.13 | 54.61,14.13 54.61,20.95 53.18,20.95 v52.23,22.07 | v52.23,24.13 52.07,24.13 52.07,28.51
  Top 0.406: U3.22 28.89,34.13 v30.16,35.4
  Bottom 0.305: v52.07,36.67 33.02,36.67 31.75,35.4 v30.16,35.4 | v52.23,22.07 v52.23,24.13
  Bottom 0.406: v30.16,35.4 30.16,39.69 J1.SCL
SCLK  (via drill 0.6)
  Top 0.305: MDL1.22 49.64,18.26 v49.69,18.26
  Bottom 0.305: v49.69,18.26 49.69,27.62 62.39,27.62 62.87,27.94 SV1.4
SDA  (via drill 0.6)
  Top 0.305: MDL1.13 54.93,26.51 54.93,23.34 53.98,23.34 | 53.98,23.34 51.44,23.34 51.44,35.72 51.12,36.04 v51.12,37.62 57.5,37.62 R2.2 | U8.9 52.52,11.14 v52.86,10.79 | v56.2,10.79 56.36,10.79 56.49,10.93 U1.9 56.49,13.2 55.09,14.61 55.09,22.07 v53.98,22.07 | v53.98,24.13 53.98,23.34
  Top 0.406: U3.23 29.84,32.86 31.11,34.13 v31.11,36.2
  Bottom 0.305: 31.11,37.15 51.12,37.15 v51.12,37.62 | v52.86,10.79 v56.2,10.79 | v53.98,22.07 v53.98,24.13
  Bottom 0.406: v31.11,36.2 31.11,37.15 31.11,41.27 J1.SDA
TX  (via drill 0.6)
  Top 0.305: U4.5 25.08,32.35 v25.08,33.02 | v54.93,32.54 54.93,32.51 MDL1.16
  Bottom 0.305: v25.08,33.02 26.99,31.11 38.73,31.11 38.73,34.13 54.13,34.13 | 54.13,34.13 54.13,32.54 v54.93,32.54 | 54.13,34.13 60.96,34.13 J1.TX
USB_D+
  Top 0.305: U4.15 10.73,38.2 10.64,38.1 JP1.D+
USB_D-
  Top 0.305: U4.16 16.83,37.55 16.83,38.9 JP1.D-
USBVCC  (via drill 0.6)
  Top 0.305: D4.A 2.38,47.15 4.92,44.61 4.92,32.07 10.32,32.07 10.95,32.7 C6.+ 13.18,33.9 C5.1 13.18,34.95 U4.20 18.26,34.95 18.26,36.51 17.3,37.47 17.3,39.37 | C9.1 29.69,14.29 29.69,16.03 | 29.69,16.03 29.69,17.49 T1.1 | U6.4 27.78,22.7 v26.67,22.7 | v30.8,16.03 29.69,16.03 | v16.67,42.55 17.3,42.55 17.3,39.37 | F1.2 15.05,39.37 17.3,39.37
  Bottom 0.305: v30.8,16.03 30.8,22.7 v26.67,22.7 32.38,22.7 32.38,25.88 29.84,28.42 24.45,28.42 19.37,33.5 19.37,40.48 17.3,42.55 v16.67,42.55
UVLO  (via drill 0.6)
  Top 0.305: R13.2 11.94,17.59 11.09,18.44 U7.7 11.09,20.64 11.11,20.64 | 12.57,20.82 R12.1 11.11,20.64 | v20.71,24.77 C8.2 | 11.11,20.64 11.11,21.91 v9.84,21.91
  Bottom 0.305: v20.71,24.77 20.71,21.91 v9.84,21.91
VBATT  (via drill 0.6)
  Top 0.254: U7.5 10.59,30.55 L1.P$2
  Top 0.305: U7.5 10.59,26.76 C12.1 | 19.37,17.46 19.37,16.03 18.89,15.56 18.89,12.38 17.94,11.43 15.88,11.43 15.88,12.86 14,12.86 R17.1 10.95,14.29 10.95,16.99 10,17.94 10,19.53 7.94,21.59 3.81,21.59 3.81,25.61 LIPO.2 | 19.37,17.46 R18.1 | 17.71,21.34 17.71,21.43 | 17.71,21.43 15.37,21.43 R12.2 | C8.1 17.71,21.43 | 19.37,17.46 19.37,18.73 18.89,19.21 18.89,21.34 17.71,21.34 | C10.1 17.71,21.34
  Top 0.61: LIPO.2 8.73,25.61 C12.1 | U6.3 v27.78,27.15
  Top 0.813: 8.69,26.72 C12.1
  Bottom 0.61: v27.78,27.15 21.11,27.15 19.53,25.56 18.89,25.56 17.94,24.61 6.99,24.61 6.03,25.56 LIPO.2
VBUS
  Top 0.305: F1.1 10.99,39.7 JP1.VBUS
VIN  (via drill 0.6)
  Top 0.305: R5.2 34.9,16.03 31.91,16.03 v31.91,16.99 | v25.4,1.75 25.4,0.79 25.24,0.79
  Top 0.61: J1.VIN 43.97,0.79 25.24,0.79 22.04,0.79 D1.C 16.19,6.64 16.19,8.26 14.76,9.68 PC1.+ 14.76,12.06 10.79,12.06 10.32,12.54 10.32,16.67 8.73,18.26 8.43,18.26 U2.3
  Bottom 0.305: v31.91,16.99 31.91,14.13 29.05,14.13 29.05,8.73 31.91,8.73 31.91,4.13 25.4,4.13 v25.4,1.75

### Text on the board
tNames: ESPUNO | mk3